# Altium schematic sheet Sch.SchDoc
size 457 x 223 mm
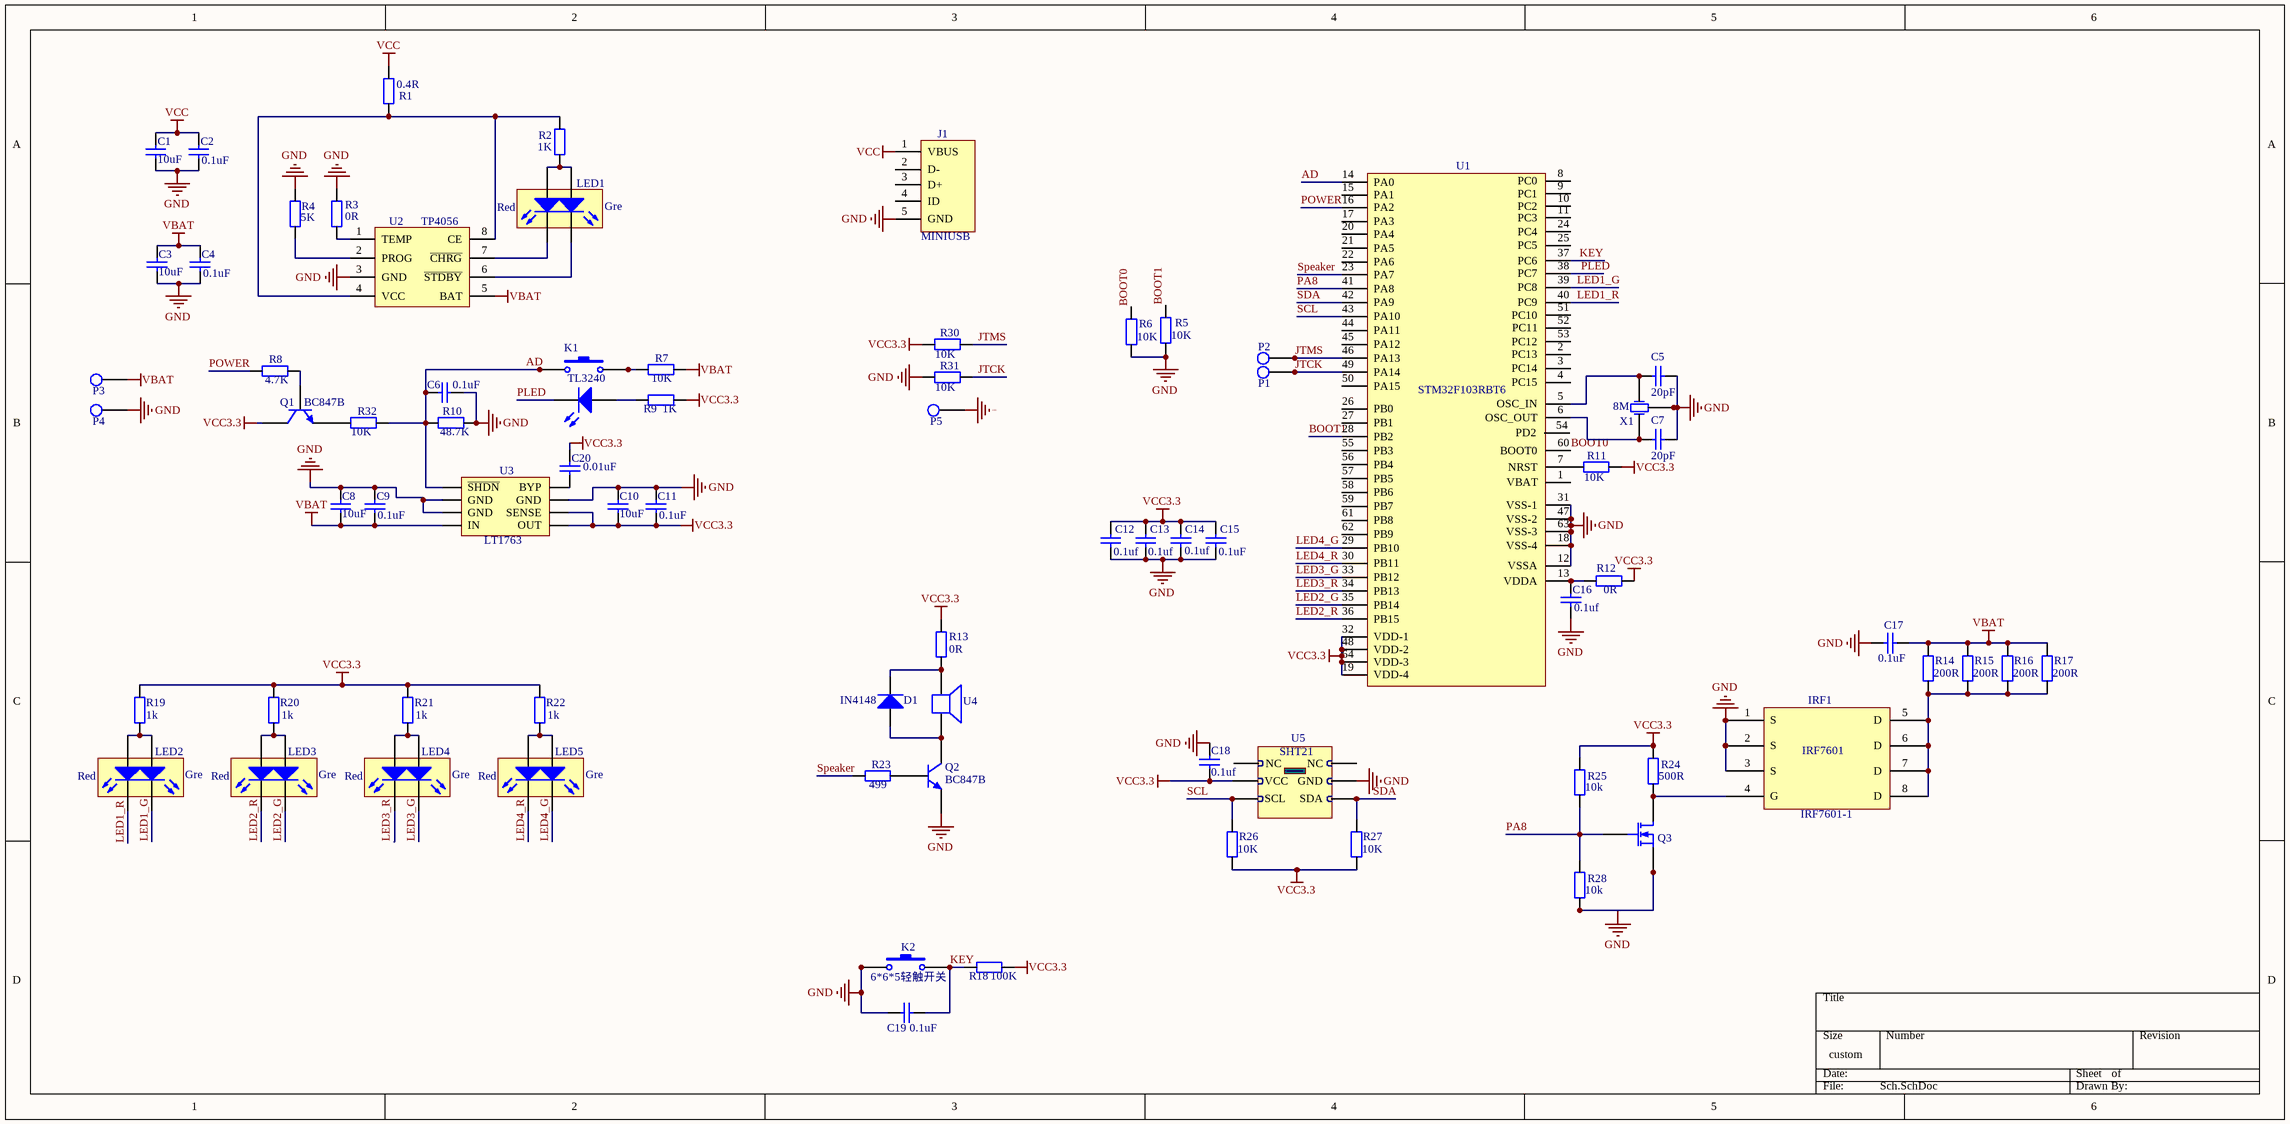
[diagram p0: Sch.SchDoc]

## Parts
C1  value 10uF  [0805]  (hidden comment: Capacitor-0805)
C2  value 0.1uF  [0603]  (hidden comment: Capacitor-0603)
C3  value 10uF  [0805]  (hidden comment: Capacitor-0805)
C4  value 0.1uF  [0603]  (hidden comment: Capacitor-0603)
C5  value 20pF  [0603]  (hidden comment: Capacitor-0805)
C6  value 0.1uF  [0603]  (hidden comment: Capacitor-0603)
C7  value 20pF  [0603]  (hidden comment: Capacitor-0805)
C8  value 10uF  [0805]  (hidden comment: Capacitor-0805)
C9  value 0.1uF  [0603]  (hidden comment: Capacitor-0603)
C10  value 10uF  [0805]  (hidden comment: Capacitor-0805)
C11  value 0.1uF  [0603]  (hidden comment: Capacitor-0603)
C12  value 0.1uf  [0603]  (hidden comment: Capacitor-0603)
C13  value 0.1uf  [0603]  (hidden comment: Capacitor-0603)
C14  value 0.1uf  [0603]  (hidden comment: Capacitor-0603)
C15  value 0.1uF  [0603]  (hidden comment: Capacitor-0603)
C16  value 0.1uf  [0603]  (hidden comment: Capacitor-0603)
C17  value 0.1uF  [0603]  (hidden comment: Capacitor-0603)
C18  value 0.1uf  [0603]  (hidden comment: Capacitor-0603)
C19  value 0.1uF  [0603]  (hidden comment: Capacitor-0603)
C20  value 0.01uF  [0603]  (hidden comment: Capacitor-0805)
D1  IN5824  [IN5824]  (value not drawn)
IRF1  IRF7601-1  [IRF7601_Micro]
J1  MINIUSB  [MicoUsb]
K1  TL3240  [TL3240]
K2  value 6*6*5轻触开关  [四脚轻触开关（6*6*5）]  (hidden comment: 轻触开关)
LED1  LED0603*2  [LED0603*2]  (value not drawn)
LED2  LED0603*2  [LED0603*2]  (value not drawn)
LED3  LED0603*2  [LED0603*2]  (value not drawn)
LED4  LED0603*2  [LED0603*2]  (value not drawn)
LED5  LED0603*2  [LED0603*2]  (value not drawn)
P1  焊盘  [测点]  (value not drawn)
P2  焊盘  [测点]  (value not drawn)
P3  焊盘  [测点]  (value not drawn)
P4  焊盘  [测点]  (value not drawn)
P5  焊盘  [测点]  (value not drawn)
Q1  BC847  [BC847B]  (value not drawn)
Q2  BC847  [BC847B]  (value not drawn)
Q3  MOSFET_N  [MOSFET_N]  (value not drawn)
R1  value 0.4R  [0603]  (hidden comment: Resistor-0603)
R2  value 1K  [0603]  (hidden comment: Resistor-0603)
R3  value 0R  [0603]  (hidden comment: Resistor-0603)
R4  value 5K  [0603]  (hidden comment: Resistor-0603)
R5  value 10K  [0603]  (hidden comment: Resistor-0603)
R6  value 10K  [0603]  (hidden comment: Resistor-0603)
R7  value 10K  [0603]  (hidden comment: Resistor-0603)
R8  value 4.7K  [0603]  (hidden comment: Resistor-0603)
R9  value 1K  [0603]  (hidden comment: Resistor-0603)
R10  value 48.7K  [0603]  (hidden comment: Resistor-0603)
R11  value 10K  [0603]  (hidden comment: Resistor-0603)
R12  value 0R  [0603]  (hidden comment: Resistor-0603)
R13  value 0R  [0603]  (hidden comment: Resistor-0603)
R14  value 200R  [0805]  (hidden comment: Resistor-0805)
R15  value 200R  [0805]  (hidden comment: Resistor-0805)
R16  value 200R  [0805]  (hidden comment: Resistor-0805)
R17  value 200R  [0805]  (hidden comment: Resistor-0805)
R18  value 100K  [0603]  (hidden comment: Resistor-0603)
R19  value 1k  [0603]  (hidden comment: Resistor-0603)
R20  value 1k  [0603]  (hidden comment: Resistor-0603)
R21  value 1k  [0603]  (hidden comment: Resistor-0603)
R22  value 1k  [0603]  (hidden comment: Resistor-0603)
R23  value 499  [0603]  (hidden comment: Resistor-0603)
R24  value 500R  [0603]  (hidden comment: Resistor-0603)
R25  value 10k  [0603]  (hidden comment: Resistor-0603)
R26  value 10K  [0603]  (hidden comment: Resistor-0603)
R27  value 10K  [0603]  (hidden comment: Resistor-0603)
R28  value 10k  [0603]  (hidden comment: Resistor-0603)
R30  value 10K  [0603]  (hidden comment: Resistor-0603)
R31  value 10K  [0603]  (hidden comment: Resistor-0603)
R32  value 10K  [0603]  (hidden comment: Resistor-0603)
U1  STM32F103RBT6  [STM32F103RBT6]
U2  TP4056  [TP4056]
U3  LT1763  [LT1963]
U4  Speaker  [Speaker（5*5*2.0）]  (value not drawn)
U5  SHIT21  [SHT21]  (value not drawn)
X1  value 8M  [3225无源晶振]  (hidden comment: 3225无源晶振)

## Nets
GND: C1.2 C2.1 C3.2 C4.1 C5.1 C6.1 C7.1 C8.1 C9.2 C10.1 C11.2 C12.1 C13.1 C14.1 C15.1 C16.1 C17.2 C18.2 C19.2 IRF1.1(S) IRF1.2(S) IRF1.3(S) J1.5(GND) K2.1 K2.2 P4.1 P5.1 Q2.1(E) R3.1 R4.1 R5.1 R6.1 R10.2 R31.2 U1.12(VSSA) U1.18(VSS-4) U1.31(VSS-1) U1.47(VSS-2) U1.63(VSS-3) U2.3(GND) U3.3(GND) U3.6(GND) U3.7(GND) U5.4(GND) X1.2(GND) X1.4(GND)
VBAT: C3.1 C4.2 C8.2 C9.1 C17.1 P3.1 R7.2 R14.2 R15.2 R16.2 R17.2 U2.5(BAT) U3.8(IN)
VCC: C1.1 C2.2 J1.1(VBUS) R1.2
VCC3.3: C10.2 C11.1 C12.2 C13.2 C14.2 C15.2 C18.1 C20.2 Q1.3(C) R9.2 R11.1 R12.1 R13.2 R18.2 R19.2 R20.2 R21.2 R22.2 R24.2 R25.2 R26.1 R27.1 R30.2 U1.19(VDD-4) U1.32(VDD-1) U1.48(VDD-2) U1.64(VDD-3) U3.1(OUT) U3.2(SENSE) U5.3(VCC)
AD: C6.2 K1.1 K1.2 R10.1 R32.1 U1.14(PA0) U3.5(~{SHDN})
BOOT0: R6.2 U1.60(BOOT0)
BOOT1: R5.2 U1.28(PB2)
JTCK: P1.1 R31.1 U1.49(PA14)
JTMS: P2.1 R30.1 U1.46(PA13)
KEY: C19.1 K2.3 K2.4 R18.1 U1.37(PC6)
LED1_G: LED2.3 U1.39(PC8)
LED1_R: LED2.4 U1.40(PC9)
LED2_G: LED3.3 U1.35(PB14)
LED2_R: LED3.4 U1.36(PB15)
LED3_G: LED4.3 U1.33(PB12)
LED3_R: LED4.4 U1.34(PB13)
LED4_G: LED5.3 U1.29(PB10)
LED4_R: LED5.4 U1.30(PB11)
PA8: Q3.1(G) R25.1 R28.2 U1.41(PA8)
PLED: K1.5 U1.38(PC7)
POWER: R8.2 U1.16(PA2)
SCL: R26.2 U1.43(PA10) U5.5(SCL)
SDA: R27.2 U1.42(PA9) U5.6(SDA)
Speaker: R23.2 U1.23(PA7)
NetC5_2: C5.2 U1.5(OSC_IN) X1.3(OSC2)
NetC7_2: C7.2 U1.6(OSC_OUT) X1.1(OSC1)
NetC16_2: C16.2 R12.2 U1.13(VDDA)
NetC20_1: C20.1 U3.4(BYP)
NetD1_1: D1.1(A) Q2.3(C) U4.1
NetD1_2: D1.2(K) R13.1 U4.2
NetIRF1_4: IRF1.4(G) Q3.3(D) R24.1
NetIRF1_5: IRF1.5(D) IRF1.6(D) IRF1.7(D) IRF1.8(D) R14.1 R15.1 R16.1 R17.1
NetK1_3: K1.3 K1.4 R7.1
NetK1_6: K1.6(A) R9.1
NetLED1_1: LED1.1(A) LED1.2(A) R2.2
NetLED1_3: LED1.3 U2.6(~{STDBY})
NetLED1_4: LED1.4 U2.7(~{CHRG})
NetLED2_1: LED2.1(A) LED2.2(A) R19.1
NetLED3_1: LED3.1(A) LED3.2(A) R20.1
NetLED4_1: LED4.1(A) LED4.2(A) R21.1
NetLED5_1: LED5.1(A) LED5.2(A) R22.1
NetQ1_1: Q1.1(E) R32.2
NetQ1_2: Q1.2(B) R8.1
NetQ2_2: Q2.2(B) R23.1
NetQ3_2: Q3.2(S) R28.1
NetR1_1: R1.1 R2.1 U2.4(VCC) U2.8(CE)
NetR3_2: R3.2 U2.1(TEMP)
NetR4_2: R4.2 U2.2(PROG)
NetR11_2: R11.2 U1.7(NRST)

Not connected (* = marked no-connect by the designer): J1 2(D-) 3(D+) 4(ID) 6 7 8 9; U1 1(VBAT) 2(PC13) 3(PC14) 4(PC15) 8(PC0) 9(PC1) 10(PC2) 11(PC3) 15(PA1) 17(PA3) 20(PA4) 21(PA5) 22(PA6) 24(PC4) 25(PC5) 26(PB0) 27(PB1) 44(PA11) 45(PA12) 50(PA15) 51(PC10) 52(PC11) 53(PC12) 54(PD2) 55(PB3) 56(PB4) 57(PB5) 58(PB6) 59(PB7) 61(PB8) 62(PB9); U5 1(NC) 2(NC)

## Notes on the sheet
- Labels drawn without touching a wire or pin: GND
- (in symbol I) IN4148
- (in symbol LED0603*2) Red; Gre

## Library data of the parts
C5 C7 = Capacitor-0
C20 = Capacitor
D1 = I
IRF1 = Component_1: IRF7601
Q3 = MOSFET_N: Value: AP2306N; Name: MOSFET_N
U4 = Speaker: Value: 5*5*2
J1 = MINIUSB: Name: MINIUSB
K1 = TL3240: Value: TL3240
LED1-LED5 = LED0603*2: Value: LED0603*2
Q1 Q2 = BC847: Name: BC847B
U1 = STM32F103RBT6: Name: STM32F103RBT6
U2 = TP4056: Value: TP4056
U3 = LT1763: Value: LT1763
U5 = SHIT21: Name: SHT21